# Altium schematic sheet SD_card.SchDoc
size A; SheetNumber: 7; SheetTotal: 12
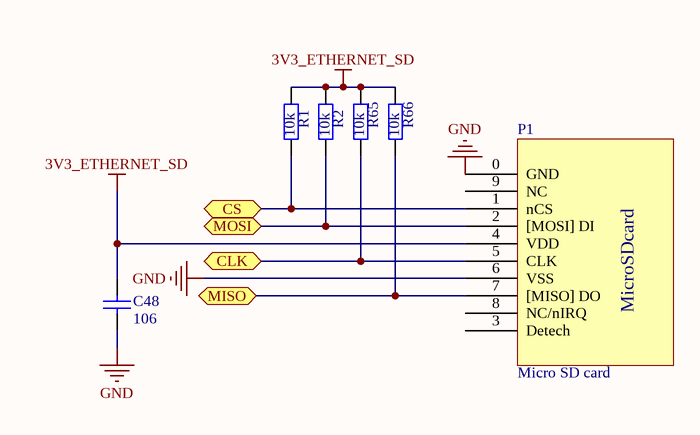
[diagram p0: SD_card.SchDoc]

## Parts
C48  106  [0603_Cap]
P1  Micro SD card  [MicroSD]
R1  10k  [0603_Res]
R2  10k  [0603_Res]
R65  10k  [0603_Res]
R66  10k  [0603_Res]

## Ports
CLK (bidir), CS (bidir), MISO (bidir), MOSI (bidir)

## Nets
3V3_ETHERNET_SD: C48.1 P1.4(VDD) R1.2 R2.2 R65.2 R66.2
GND: C48.2 P1.0(GND) P1.6(VSS)
CLK: P1.5(CLK) R65.1 ; port CLK
CS: P1.1(nCS) R1.1 ; port CS
MISO: P1.7([MISO]_DO) R66.1 ; port MISO
MOSI: P1.2([MOSI]_DI) R2.1 ; port MOSI

Not connected (* = marked no-connect by the designer): P1 3(Detech) 8(NC/nIRQ) 9(NC)

## Notes on the sheet
- (in symbol Micro SD card) MicroSDcard

## Library data of the parts
C48 = Ceramic Capacitor: Chung_Loai: Dán; Don_Vi: Con; So_Chan: 2; Ten_Linh_Kien: Tụ 0805 104-100nF 10% 50V; Ma_Hang: MH004551; Kieu_Chan: *
R1 R2 R65 R66 = Resistor: Chung_Loai: Dán; Don_Vi: Con; So_Chan: 2; Ten_Linh_Kien: Trở 0805 1% 1k; Ma_Hang: MH005468; Kieu_Chan: *